# EasyEDA Pro project STM32.epro

# Schematic Schematic1
Board Name: Board1; Create Date: 2025-08-23; Page Name: P1; Project Name: STM32; Schematic Name: Schematic1; Update Date: 2025-08-27; Company: 嘉立创EDA; Page Size: A4; Version: V1.0
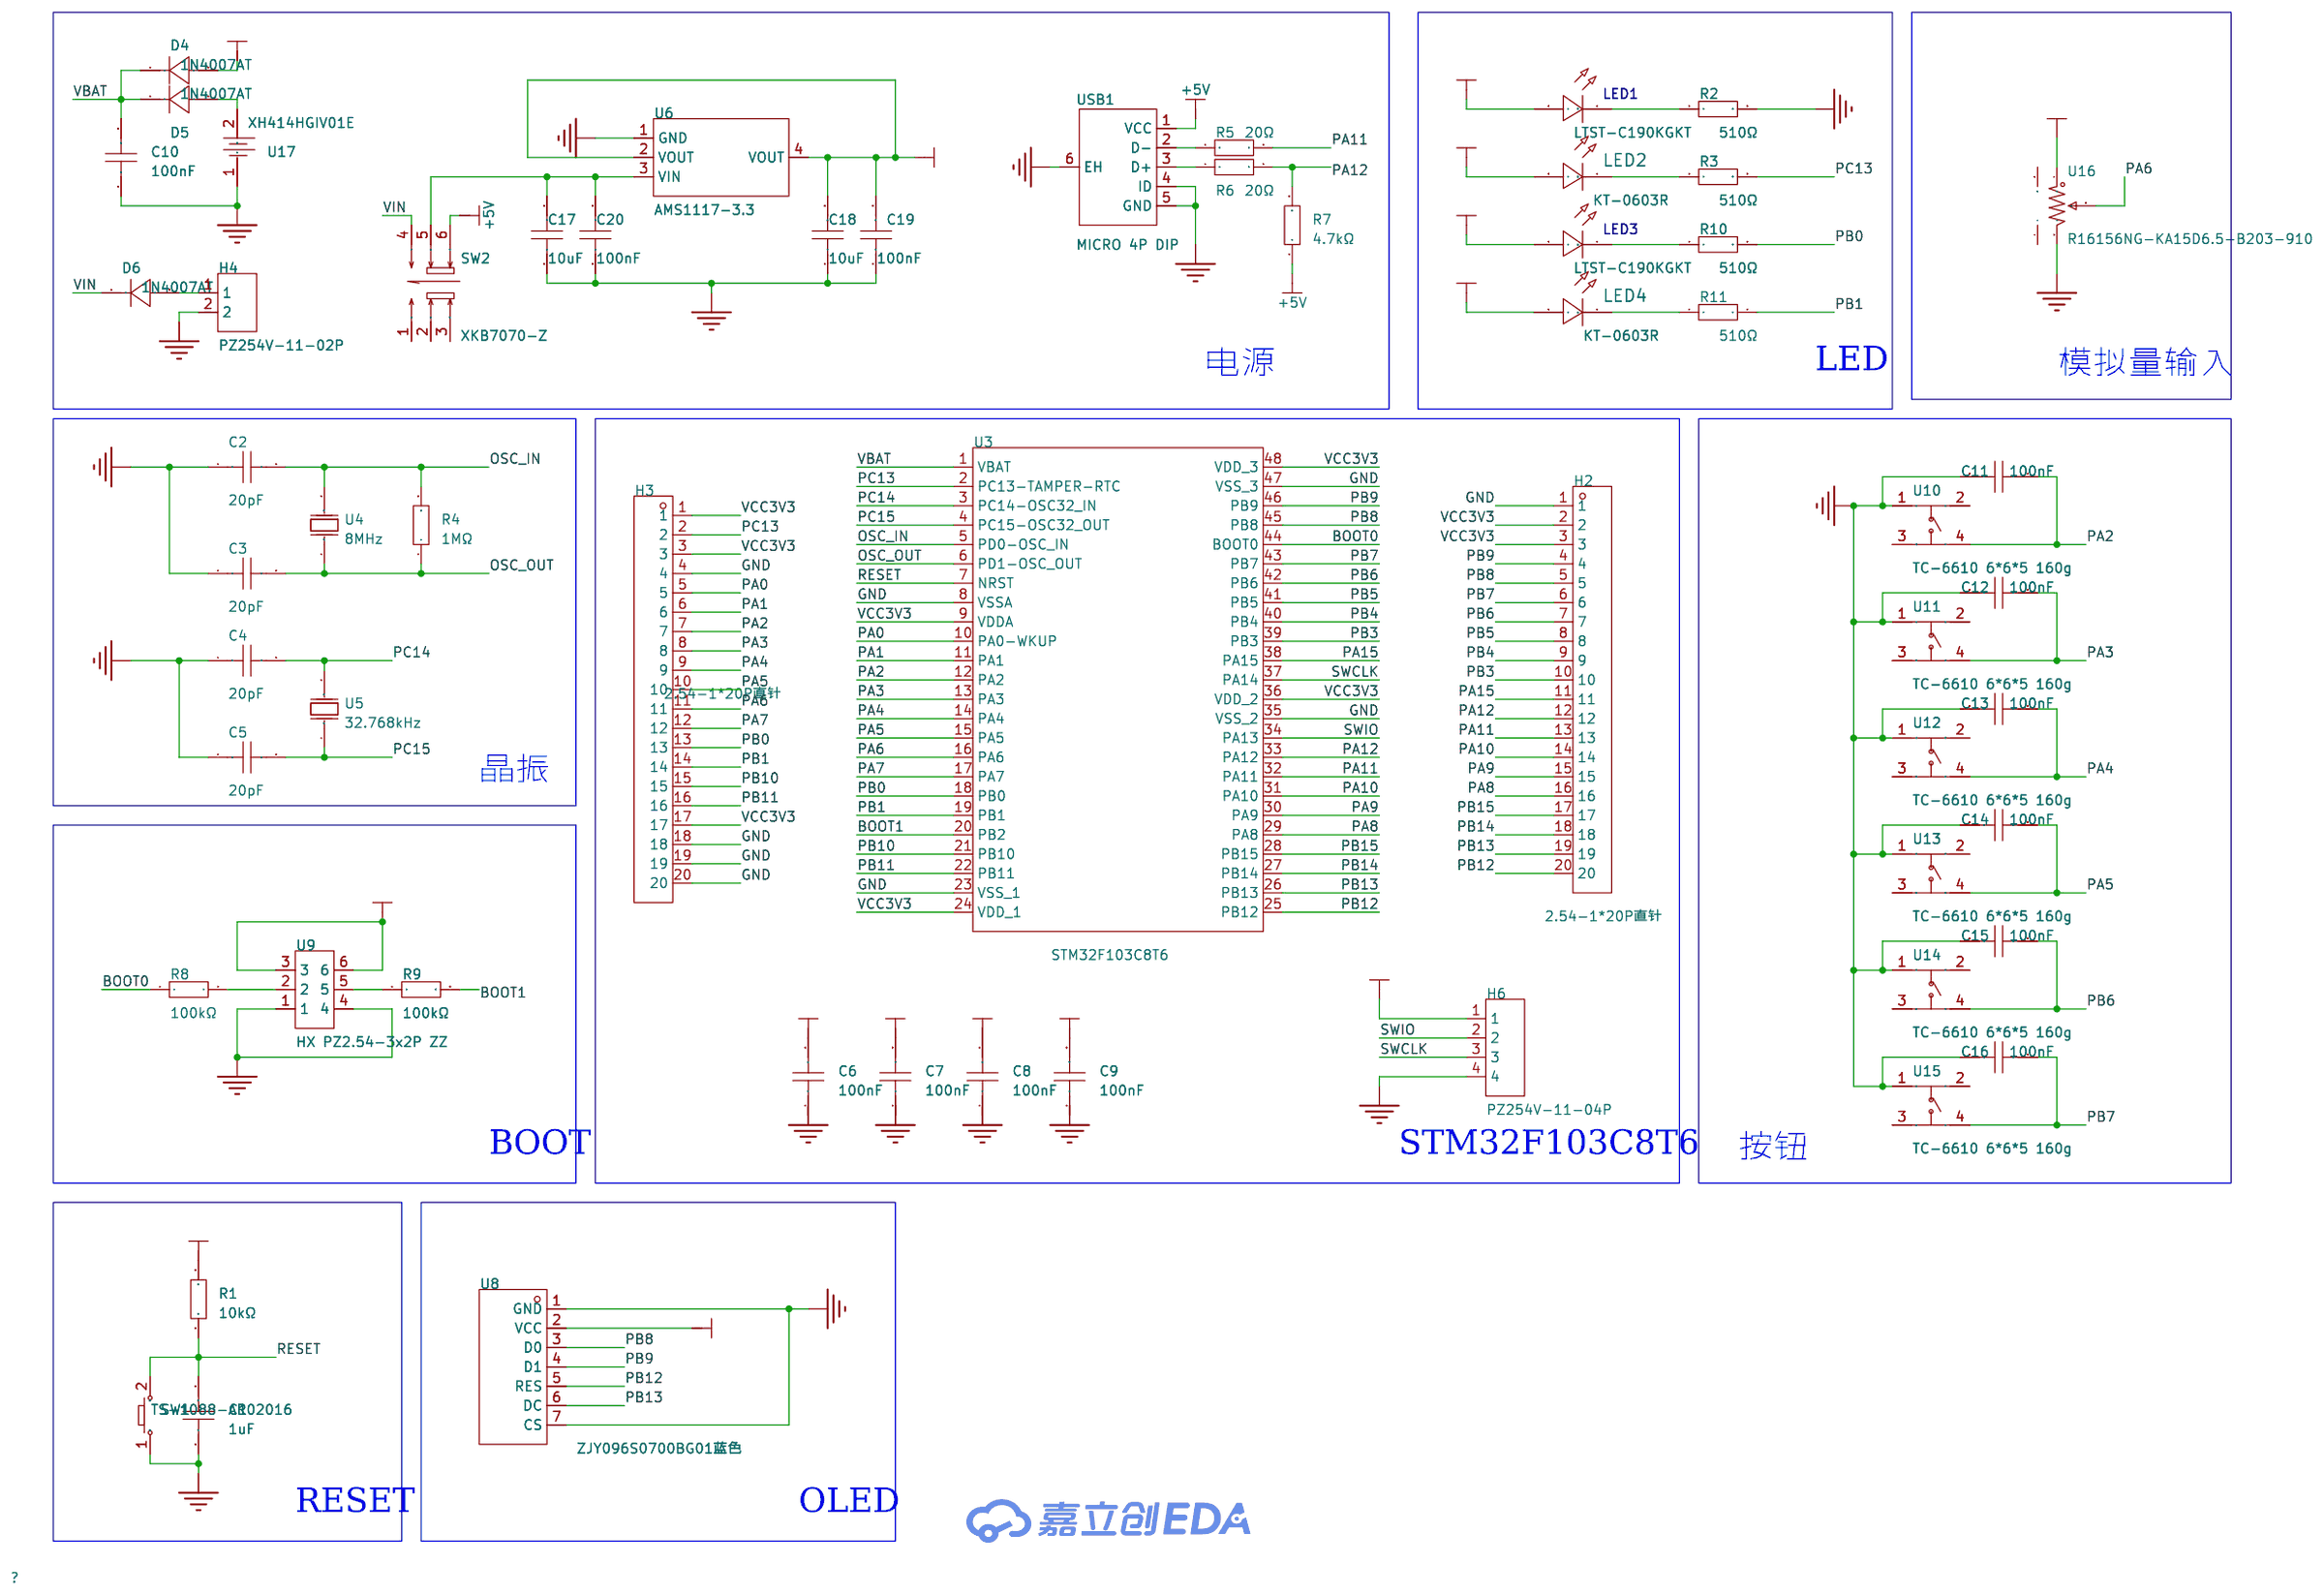
[diagram p0: schematic sheet]

## Parts
C1  1uF  [C0603]
C2  20pF  [C0603]
C3  20pF  [C0603]
C4  20pF  [C0603]
C5  20pF  [C0603]
C6  100nF  [C0603]
C7  100nF  [C0603]
C8  100nF  [C0603]
C9  100nF  [C0603]
C10  100nF  [C0603]
C11  100nF  [C0603]
C12  100nF  [C0603]
C13  100nF  [C0603]
C14  100nF  [C0603]
C15  100nF  [C0603]
C16  100nF  [C0603]
C17  10uF  [C0603]
C18  10uF  [C0603]
C19  100nF  [C0603]
C20  100nF  [C0603]
D4  1N4007AT  [DO_1N4007]
D5  1N4007AT  [DO_1N4007]
D6  1N4007AT  [DO_1N4007]
H2  2.54-1*20P直针  [HDR-TH_20P-P2.54-V-M-1]
H3  2.54-1*20P直针  [HDR-TH_20P-P2.54-V-M-1]
H4  PZ254V-11-02P  [HDR-TH_2P-P2.54-V-M]
H6  PZ254V-11-04P  [HDR-TH_4P-P2.54-V-M]
LED1  LTST-C190KGKT  [LED0603-RD]
LED2  KT-0603R  [LED0603-RD]
LED3  LTST-C190KGKT  [LED0603-RD]
LED4  KT-0603R  [LED0603-RD]
R1  10kΩ  [R0603]
R2  510Ω  [R0603]
R3  510Ω  [R0603]
R4  1MΩ  [R0603]
R5  20Ω  [R0603]
R6  20Ω  [R0603]
R7  4.7kΩ  [R0603]
R8  100kΩ  [R0603]
R9  100kΩ  [R0603]
R10  510Ω  [R0603]
R11  510Ω  [R0603]
SW1  TS-1088-AR02016  [Key_SMD_3x4x2]
SW2  XKB7070-Z  [SW-TH_6P-L7.0-W7.0-P2.00]
U3  STM32F103C8T6  [LQFP-48_L7.0-W7.0-P0.50-LS9.0-BL]
U4  8MHz  [HC-49S_L11.5-W5.0-P4.88]
U5  32.768kHz  [CRYSTAL-SMD_L3.2-W1.5]
U6  AMS1117-3.3  [SOT-223-3_L6.5-W3.4-P2.30-LS7.0-BR]
U8  ZJY096S0700BG01蓝色  [OLED-TH_OLED0.96-SPI]
U9  HX PZ2.54-3x2P ZZ  [HDR-TH_6P-P2.54-V-M-R3-C2-S2.54_2]
U10  TC-6610 6*6*5 160g  [SW-TH_4P-L6.0-W6.0-P4.50-LS6.5]
U11  TC-6610 6*6*5 160g  [SW-TH_4P-L6.0-W6.0-P4.50-LS6.5]
U12  TC-6610 6*6*5 160g  [SW-TH_4P-L6.0-W6.0-P4.50-LS6.5]
U13  TC-6610 6*6*5 160g  [SW-TH_4P-L6.0-W6.0-P4.50-LS6.5]
U14  TC-6610 6*6*5 160g  [SW-TH_4P-L6.0-W6.0-P4.50-LS6.5]
U15  TC-6610 6*6*5 160g  [SW-TH_4P-L6.0-W6.0-P4.50-LS6.5]
U16  R16156NG-KA15D6.5-B203-910  [RES-ADJ-TH_R16156NG-KA15D6.5-B203-910]
U17  XH414HGIV01E  [CAP-SMD_2P-L4.8-W4.8-TR]
USB1  MICRO 4P DIP  [USB_Micro]

## Library data of the parts
C1 = CL10A105KO8NNNC: 容值:1uF;精度:±10%;额定电压:16V;温度系数:X5R;; LCSC Part Name: 1uF ±10% 16V; Supplier Part: C1592; Manufacturer: SAMSUNG(三星); Supplier Footprint: 0603; JLCPCB Part Class: Extended Part; Datasheet: https://item.szlcsc.com/datasheet/CL10A105KO8NNNC/1944.html; Supplier: LCSC; Tolerance: ±10%; Voltage Rating: 16V; Temperature Coefficient: X5R
C2-C5 = CC0603JRNPO9BN200: 容值:20pF;精度:±5%;额定电压:50V;材质(温度系数):NP0;; LCSC Part Name: 20pF ±5% 50V; Supplier Part: C105621; Manufacturer: YAGEO(国巨); Supplier Footprint: 0603; JLCPCB Part Class: Extended Part; Datasheet: https://atta.szlcsc.com/upload/public/pdf/source/20170505/1493957838062.pdf; Supplier: LCSC; Tolerance: ±5%; Voltage Rated: 50V; Temperature Coefficient: NP0
C6-C10 = CGA0603X7R104K500JT: 容值:100nF;精度:±10%;额定电压:50V;温度系数:X7R;; LCSC Part Name: 100nF ±10% 50V; Supplier Part: C6119867; Manufacturer: HRE(芯声); Supplier Footprint: 0603; JLCPCB Part Class: Extended Part; Datasheet: https://atta.szlcsc.com/upload/public/pdf/source/20250103/C44077DA9E7B3EFAE02F22B6D3D1CBC9.pdf; Supplier: LCSC; Tolerance: ±10%; Voltage Rating: 50V; Temperature Coefficient: X7R
C11-C16 C19 C20 = CL10B104KA8NNNC: 容值:100nF;精度:±10%;额定电压:25V;温度系数:X7R;; LCSC Part Name: 100nF ±10% 25V; Supplier Part: C1590; Manufacturer: SAMSUNG(三星); Supplier Footprint: 0603; JLCPCB Part Class: Extended Part; Datasheet: https://item.szlcsc.com/datasheet/CL10B104KA8NNNC/1942.html; Supplier: LCSC; Tolerance: ±10%; Voltage Rating: 25V; Temperature Coefficient: X7R
C17 C18 = CL10A106KP8NNNC: 容值:10uF;精度:±10%;额定电压:10V;温度系数:X5R;; LCSC Part Name: 10uF ±10% 10V; Supplier Part: C19702; Manufacturer: SAMSUNG(三星); Supplier Footprint: 0603; JLCPCB Part Class: Basic Part; Datasheet: https://item.szlcsc.com/datasheet/CL10A106KP8NNNC/20411.html; Supplier: LCSC; Tolerance: ±10%; Voltage Rating: 10V; Temperature Coefficient: X5R
D4-D6 = 1N4007AT: 二极管配置:-;正向压降(Vf):1.1V@1A;直流反向耐压(Vr):1kV;整流电流:1A;; Supplier Part: C2921011; Manufacturer: Agertech(艾吉芯); Supplier Footprint: DO-41; JLCPCB Part Class: Extended Part; Datasheet: https://item.szlcsc.com/datasheet/1N4007AT/3228639.html; Supplier: LCSC; Voltage - Forward(Vf@If): 1.1V@1A; Voltage - DC Reverse(Vr): 1kV; Current - Rectified: 1A; Reverse Leakage Current (Ir): 5uA@1kV; Non-Repetitive Peak Forward Surge Current: 30A; Operating Junction Temperature Range: -65℃~+175℃
H2 H3 = 2.54-1*20P直针: 插针结构:1x20P;间距:2.54mm;行距:-;圆针/方针:方针;安装方式:直插;排数:单排;总PIN位数:20P;额定电流:3A;额定电压:-;配合针长度:-;塑高:-;端接针长度:-;触头材质:黄铜;触头镀层:-;工作温度:-40℃~+105℃;颜色:黑色;; LCSC Part Name: 1x20P 间距:2.54mm 方针 直插; Supplier Part: C50981; Manufacturer: BOOMELE(博穆精密); Supplier Footprint: 插件,P=2.54mm; JLCPCB Part Class: Extended Part; Datasheet: https://item.szlcsc.com/datasheet/2.54-1*20P%25E7%259B%25B4%25E9%2592%2588/51993.html; Supplier: LCSC; Pin Structure: 1x20P; Pitch: 2.54mm; Circluar Pins/Square Pins: 方针; Mounting Type: 直插; Number of Rows: 单排; Number of Pins: 20P; Current Rating: 3A; Contact Material: 黄铜; Operating Temperature: -40℃~+105℃; Color: 黑色
H4 = PZ254V-11-02P: 插针结构:1x2P;间距:2.54mm;行距:-;圆针/方针:方针;安装方式:直插;排数:单排;总PIN位数:2P;额定电流:-;额定电压:-;配合针长度:6mm;塑高:2.5mm;端接针长度:3mm;触头材质:黄铜;触头镀层:-;工作温度:-40℃~+105℃;颜色:黑色;; LCSC Part Name: 1x2P 间距:2.54mm 方针 直插; Supplier Part: C492401; Manufacturer: XFCN(兴飞); Supplier Footprint: 插件,P=2.54mm; JLCPCB Part Class: 扩展库; Datasheet: https://item.szlcsc.com/datasheet/PZ254V-11-02P/502957.html; Supplier: LCSC; Pin Structure: 1x2P; Pitch: 2.54mm; Circluar Pins/Square Pins: 方针; Mounting Type: 直插; Number of Rows: 单排; Number of Pins: 2P; Length of Mating Pin: 6mm; Insulation Height: 2.5mm; Length of End Connection Pin: 3mm; Contact Material: 黄铜; Operating Temperature: -40℃~+105℃; Color: 黑色
H6 = PZ254V-11-04P_C492403: 插针结构:1x4P;间距:2.54mm;行距:-;圆针/方针:方针;安装方式:直插;排数:单排;总PIN位数:4P;额定电流:-;额定电压:-;配合针长度:6mm;塑高:2.5mm;端接针长度:3mm;触头材质:黄铜;触头镀层:-;工作温度:-40℃~+105℃;颜色:黑色;; LCSC Part Name: 1x4P 间距:2.54mm 方针 直插; Supplier Part: C492403; Manufacturer: XFCN(兴飞); Supplier Footprint: 插件,P=2.54mm; JLCPCB Part Class: Extended Part; Datasheet: https://atta.szlcsc.com/upload/public/pdf/source/20200309/C492403_F9F19131791D08044AD4F84F8E751A34.pdf; Supplier: LCSC; Pin Structure: 1x4P; Pitch: 2.54mm; Circluar Pins/Square Pins: 方针; Mounting Type: 直插; Number of Rows: 单排; Number of Pins: 4P; Length of Mating Pin: 6mm; Insulation Height: 2.5mm; Length of End Connection Pin: 3mm; Contact Material: 黄铜; Operating Temperature: -40℃~+105℃; Color: 黑色
LED1 LED3 = LTST-C190KGKT: 发光颜色:黄绿色;正向电压(VF):2V;功率:75mW;正向电流:20mA;主波长:567.5nm~576.5nm;二极管配置:-;透镜颜色:无色透明透镜;色温:-;发光强度:35mcd;发光角度:130°;载带方式:-;工作温度:-30℃~+85℃;; LCSC Part Name: 普绿/黄绿; Supplier Part: C125094; Manufacturer: LITEON(光宝); Supplier Footprint: 0603; JLCPCB Part Class: Extended Part; Datasheet: https://atta.szlcsc.com/upload/public/pdf/source/20180129/C125094_15171883203831315957.pdf; Supplier: LCSC; Emitted Color: 黄绿色; Forward Voltage (VF): 2V; Power Dissipation: 75mW; Forward Current: 20mA; Dominant Wavelength: 567.5nm~576.5nm; Peak Wavelength: 574nm; Lens Color: 无色透明透镜; Luminous Intensity: 35mcd; Viewing Angle: 130°; Operating Temperature: -30℃~+85℃
LED2 LED4 = KT-0603R: 发光颜色:红色;功率:-;正向电流:-;主波长:-;二极管配置:-;透镜颜色:-;色温:-;发光角度:-;载带方式:-;工作温度:-40℃~+85℃;; LCSC Part Name: 0603 红灯 高亮; Supplier Part: C2286; Manufacturer: KENTO; Supplier Footprint: 0603; JLCPCB Part Class: Basic Part; Datasheet: https://atta.szlcsc.com/upload/public/pdf/source/20160616/1466072038404.pdf; Supplier: LCSC; Emitted Color: 红色; Operating Temperature: -40℃~+85℃
R1 = 0603WAF1002T5E: 电阻类型:厚膜电阻;阻值:10kΩ;精度:±1%;功率:100mW;工作电压:75V;温度系数:±100ppm/℃;; LCSC Part Name: 厚膜电阻 10kΩ ±1% 100mW; Supplier Part: C25804; Manufacturer: UNI-ROYAL(厚声); Supplier Footprint: 0603; JLCPCB Part Class: Basic Part; Datasheet: https://item.szlcsc.com/datasheet/0603WAF1002T5E/26547.html; Supplier: LCSC; Type: 厚膜电阻; Tolerance: ±1%; Power(Watts): 100mW; Voltage-Supply(Max): 75V; Temperature Coefficient: ±100ppm/℃; Operating Temperature: -55℃~+155℃
R2 R3 R10 R11 = 0603WAF5100T5E: 电阻类型:厚膜电阻;阻值:510Ω;精度:±1%;功率:100mW;工作电压:75V;温度系数:±100ppm/℃;; LCSC Part Name: 510Ω ±1% 100mW 厚膜电阻; Supplier Part: C23193; Manufacturer: UNI-ROYAL(厚声); Supplier Footprint: 0603; JLCPCB Part Class: Basic Part; Datasheet: https://item.szlcsc.com/datasheet/0603WAF5100T5E/23920.html; Supplier: LCSC; Type: 厚膜电阻; Tolerance: ±1%; Power(Watts): 100mW; Voltage-Supply(Max): 75V; Temperature Coefficient: ±100ppm/℃; Operating Temperature: -55℃~+155℃
R4 = 0603WAF1004T5E: 电阻类型:厚膜电阻;阻值:1MΩ;精度:±1%;功率:100mW;最大工作电压:75V;温度系数:±100ppm/℃;; LCSC Part Name: 1MΩ ±1% 100mW 厚膜电阻; Supplier Part: C22935; Manufacturer: UNI-ROYAL(厚声); Supplier Footprint: 0603; JLCPCB Part Class: Basic Part; Datasheet: https://atta.szlcsc.com/upload/public/pdf/source/20200306/C422600_1E6D84923E4A46A82E41ADD87F860B5C.pdf; Supplier: LCSC; Type: 厚膜电阻; Tolerance: ±1%; Power(Watts): 100mW; Overload Voltage (Max): 75V; Temperature Coefficient: ±100ppm/℃; Operating Temperature Range: -55℃~+155℃
R5 R6 = 0603WAF200JT5E: 电阻类型:厚膜电阻;阻值:20Ω;精度:±1%;功率:100mW;最大工作电压:75V;温度系数:±100ppm/℃;; LCSC Part Name: 20Ω ±1% 100mW 厚膜电阻; Supplier Part: C22950; Manufacturer: UNI-ROYAL(厚声); Supplier Footprint: 0603; JLCPCB Part Class: Basic Part; Datasheet: https://atta.szlcsc.com/upload/public/pdf/source/20200306/C422600_1E6D84923E4A46A82E41ADD87F860B5C.pdf; Supplier: LCSC; Type: 厚膜电阻; Tolerance: ±1%; Power(Watts): 100mW; Overload Voltage (Max): 75V; Temperature Coefficient: ±100ppm/℃; Operating Temperature Range: -55℃~+155℃
R7 = 0603WAF4701T5E: 电阻类型:厚膜电阻;阻值:4.7kΩ;精度:±1%;功率:100mW;工作电压:75V;温度系数:±100ppm/℃;; LCSC Part Name: 4.7kΩ ±1% 100mW 厚膜电阻; Supplier Part: C23162; Manufacturer: UNI-ROYAL(厚声); Supplier Footprint: 0603; JLCPCB Part Class: Basic Part; Datasheet: https://item.szlcsc.com/datasheet/0603WAF4701T5E/23889.html; Supplier: LCSC; Type: 厚膜电阻; Tolerance: ±1%; Power(Watts): 100mW; Voltage-Supply(Max): 75V; Temperature Coefficient: ±100ppm/℃; Operating Temperature: -55℃~+155℃
R8 R9 = 0603WAF1003T5E: 电阻类型:厚膜电阻;阻值:100kΩ;精度:±1%;功率:100mW;工作电压:75V;温度系数:±100ppm/℃;; LCSC Part Name: 100kΩ ±1% 100mW 厚膜电阻; Supplier Part: C25803; Manufacturer: UNI-ROYAL(厚声); Supplier Footprint: 0603; JLCPCB Part Class: Basic Part; Datasheet: https://item.szlcsc.com/datasheet/0603WAF1003T5E/26546.html; Supplier: LCSC; Type: 厚膜电阻; Tolerance: ±1%; Power(Watts): 100mW; Voltage-Supply(Max): 75V; Temperature Coefficient: ±100ppm/℃; Operating Temperature: -55℃~+155℃
SW1 = TS-1088-AR02016: 电路结构:单刀单掷;按钮形状:圆形按钮;作用力:160gf;安装方式:立贴;开关长度:4mm;开关宽度:3mm;开关高度:2mm;带支架:不带;触点电流:50mA;额定电压(DC):12V;绝缘电阻:100MΩ;机械寿命:10万次;; LCSC Part Name: 4*3*2mm 立贴 轻触开关; Supplier Part: C720477; Manufacturer: XUNPU(讯普); Supplier Footprint: SMD; JLCPCB Part Class: Basic Part; Datasheet: https://atta.szlcsc.com/upload/public/pdf/source/20200810/C720475_60D09DD6C54279ADDB2DC25100F1CC11.pdf; Supplier: LCSC; Circuit: 单刀单掷; Actuator Style: 圆形按钮; Operating Force: 160gf; Mounting Style: 立贴; Switch Length: 4mm; Switch Width: 3mm; Switch Height: 2mm; Strike Gundam: 不带; Contact Current: 50mA; Voltage Rating (DC): 12V; Insulation Resistance: 100MΩ; Actuator/Cap Color: 黑色; Pin Style: SMD接片; Mechanical Life: 10万次; Operating Temperature: -30℃~+80℃
SW2 = XKB7070-Z: 自锁/无锁:自锁;安装方式:直插;触点电流:100mA;额定电压 (AC):250V;额定电压 (DC):30V;带灯:不带;作用力:160gf;机械寿命:10万次;; LCSC Part Name: 按键开关   7*7插件自锁 蓝白黑; Supplier Part: C318863; Manufacturer: XKB Connectivity(中国星坤); Supplier Footprint: 插件; JLCPCB Part Class: 扩展库; Datasheet: https://atta.szlcsc.com/upload/public/pdf/source/20211015/75A682A27A424BDE8D93C2CFA14C38FE.pdf; Supplier: LCSC; Self Lock / No Lock: 自锁; Actuator Style: 矩形按钮; Mounting Style: 直插; Contact Current: 100mA; Voltage Rating (AC): 250V; Voltage Rating (DC): 30V; Insulation Resistance: 100MΩ; Actuator/Cap Color: 蓝色; With Lamp: 不带; Pin Style: PC引脚; Operating Force: 160gf; Operating Temperature: -15℃~+55℃; Mechanical Life: 10万次
U3 = STM32F103C8T6: CPU内核:ARM-M3;CPU最大主频:72MHz;应用领域:-;; LCSC Part Name: 主流增强型ARM Cortex-M3 MCU，具有64 KB Flash、72 MHz CPU、电机控制、USB和CAN; Supplier Part: C8734; Manufacturer: ST(意法半导体); Supplier Footprint: LQFP-48(7x7); JLCPCB Part Class: 扩展库; Datasheet: https://item.szlcsc.com/datasheet/STM32F103C8T6/9243.html; Supplier: LCSC; CPU Core: ARM-M3; CPU Maximum Speed: 72MHz; Program Storage Size: 64KB; Program Memory Type: FLASH; Number of I/O: 37; ADC (Bit): 12bit; Voltage - Supply: 2V~3.6V
U4 = RB080001184: 频率:8MHz;常温频差:±20ppm;外接负载电容:20pF;频率稳定度(全温):±30ppm;; LCSC Part Name: 8MHz ±20ppm 20pF; Supplier Part: C7206209; Manufacturer: TROQ(创捷); Supplier Footprint: HC-49S; Datasheet: https://atta.szlcsc.com/upload/public/pdf/source/20230606/2B7EB517C34FF5D54F15C17EF1994A2D.pdf; Supplier: LCSC; Normal temperature Frequency Tolerance: ±20ppm; External load capacitor: 20pF; Frequency Stability(Full temperature range): ±30ppm; Operating Temperature: -40℃~+85℃
U5 = RNE32768082: 晶振类型:贴片晶振;频率:32.768kHz;常温频差:±10ppm;外接负载电容:12.5pF;; LCSC Part Name: 32.768kHz ±10ppm 12.5pF; Supplier Part: C19173092; Manufacturer: TROQ(创捷); Supplier Footprint: SMD3215-2P; JLCPCB Part Class: 扩展库; Datasheet: https://atta.szlcsc.com/upload/public/pdf/source/20231030/E9B07A2B101565E78C41C08206074D11.pdf; Supplier: LCSC; Crystal Type: 贴片晶振; Normal temperature Frequency Tolerance: ±10ppm; External load capacitor: 12.5pF; Operating Temperature: -40℃~+85℃
U6 = AMS1117-3.3_C6186: 输出类型:固定;工作电压:16V;输出电压:3.3V;输出电流:1A;电源纹波抑制比(PSRR):72dB@(120Hz);输出极性:正极;; LCSC Part Name: 输出3.3V 1A; Supplier Part: C6186; Manufacturer: AMS; Supplier Footprint: SOT-223; JLCPCB Part Class: 基础库; Datasheet: https://item.szlcsc.com/datasheet/AMS1117-3.3/6652.html; Supplier: LCSC; Output Type: 固定; Voltage - Supply: 16V; Output Voltage: 3.3V; Output Current: 1A; Power Supply Rejection Ratio (PSRR): 72dB@(120Hz); Voltage Dropout: 1.1V@(800mA); standby current: 5mA; Features: 过流保护；过热保护; Operating Temperature: -40℃~+125℃; Output Configuration: 正极; Number of Outputs: 1
U8 = ZJY096S0700BG01蓝色: Supplier Part: C9900027058; Supplier Footprint: THrough hole; JLCPCB Part Class: 扩展库; Supplier: LCSC; Check: false
U9 = HX PZ2.54-3x2P ZZ: 插针结构:3x2P;间距:2.54mm;行距:2.54mm;圆针/方针:方针;安装方式:直插;排数:三排;总PIN位数:6P;额定电流:3A;额定电压:-;配合针长度:6mm;塑高:2.5mm;端接针长度:3mm;触头材质:黄铜;触头镀层:金;工作温度:-40℃~+105℃;颜色:黑色;; LCSC Part Name: 3x2P 间距:2.54mm 方针 直插; Supplier Part: C32713289; Manufacturer: hanxia(韩下); Supplier Footprint: 插件,P=2.54mm; JLCPCB Part Class: 扩展库; Datasheet: https://item.szlcsc.com/datasheet/HX%2520PZ2.54-3x2P%2520ZZ/34444569.html; Supplier: LCSC; Pin Structure: 3x2P; Pitch: 2.54mm; Row Spacing: 2.54mm; Circluar Pins/Square Pins: 方针; Mounting Type: 直插; Number of Rows: 三排; Number of Pins: 6P; Current Rating: 3A; Length of Mating Pin: 6mm; Insulation Height: 2.5mm; Length of End Connection Pin: 3mm; Contact Material: 黄铜; Contact Plating: 金; Operating Temperature: -40℃~+105℃; Color: 黑色
U10-U15 = TC-6610 6*6*5 160g: 轻触开关  6*6*5 160g力 4.3基座 复银 耐温 ROHS; Supplier Part: C7528706; Manufacturer: FG(富港); Supplier Footprint: 插件,6x6mm; JLCPCB Part Class: 扩展库; Datasheet: https://atta.szlcsc.com/upload/public/pdf/source/20240119/C4B5B07B03893BE63D1CA58047A0B7F3.pdf; Supplier: LCSC
U16 = R16156NG-KA15D6.5-B203-910: 可调电阻旋转电位器单联，旋转角度：300+/-5°，旋转寿命：10000次，使用温度：-10°~+70°; Supplier Part: C19712520; Manufacturer: CTR(长泰尔电子); Supplier Footprint: SIP-3; JLCPCB Part Class: Extended Part; Datasheet: https://atta.szlcsc.com/upload/public/pdf/source/20231222/E479C4CE3DF3C1EB7BA16745320BA9DD.pdf; Supplier: LCSC; Rated Voltage: 20V
U17 = XH414HGIV01E: LCSC Part Name: Seiko/精工，锂电池，3.3V，XH414HGIV01E ，1个; Supplier Part: C916085; Manufacturer: Seiko(精工); Supplier Footprint: SMD,1.9x6.8mm; JLCPCB Part Class: 扩展库; Datasheet: https://item.szlcsc.com/datasheet/XH414HGIV01E/990251.html; Supplier: LCSC
USB1 = MICRO 4P DIP: 连接器类型:Micro-B;标准:USB 2.0;公母:母;安装方式:卧贴;触点数量:5P;端口数量:1;额定电流 - 电源:1A;工作温度范围:-30℃~+80℃;; LCSC Part Name: Micro-B 母 卧贴; Supplier Part: C456008; Manufacturer: SHOU HAN(首韩); Supplier Footprint: SMD; JLCPCB Part Class: Extended Part; Datasheet: https://atta.szlcsc.com/upload/public/pdf/source/20191113/C456008_715AB785ACAEB21AD2CB341B96491593.pdf; Supplier: LCSC; Connector Type: Micro-B; Standard: USB 2.0; Gender: 母; Mounting Style: 卧贴; Number of Contacts: 5P; Number of Ports: 1; Current Rating - Power (Max): 1A; Operating Temperature Range: -30℃~+80℃; Core Colour: 黑色

## Nets
+5V: R7.1 SW2.6 USB1.1(VCC)
GND: C1.1 C2.1 C3.1 C4.1 C5.1 C6.1 C7.1 C8.1 C9.1 C10.1 C11.2 C12.2 C13.2 C14.2 C15.2 C16.2 C17.1 C18.1 C19.1 C20.1 H2.1 H3.4 H3.18 H3.19 H3.20 H4.2 H6.4 R2.2 SW1.1 U3.8(VSSA) U3.23(VSS_1) U3.35(VSS_2) U3.47(VSS_3) U6.1(GND) U8.1(GND) U8.7(CS) U9.1 U9.4 U10.1 U11.1 U12.1 U13.1 U14.1 U15.1 U16.3 U17.1 USB1.4(ID) USB1.5(GND) USB1.6(EH)
VBAT: C10.2 D4.1(K) D5.1(K) U3.1(VBAT)
VCC3V3: C6.2 C7.2 C8.2 C9.2 C18.2 C19.2 D4.2(A) H2.2 H2.3 H3.1 H3.3 H3.17 H6.1 LED1.2(A) LED2.2(A) LED3.2(A) LED4.2(A) R1.2 U3.9(VDDA) U3.24(VDD_1) U3.36(VDD_2) U3.48(VDD_3) U6.2(VOUT) U6.4(VOUT) U8.2(VCC) U9.3 U9.6 U16.1
VIN: D6.1(K) SW2.4
BOOT0: R8.1 U3.44(BOOT0)
BOOT1: R9.2 U3.20(PB2)
OSC_IN: C2.2 R4.2 U3.5(PD0-OSC_IN) U4.2(OSC2)
OSC_OUT: C3.2 R4.1 U3.6(PD1-OSC_OUT) U4.1(OSC1)
PA0: H3.5 U3.10(PA0-WKUP)
PA1: H3.6 U3.11(PA1)
PA2: C11.1 H3.7 U3.12(PA2) U10.4
PA3: C12.1 H3.8 U3.13(PA3) U11.4
PA4: C13.1 H3.9 U3.14(PA4) U12.4
PA5: C14.1 H3.10 U3.15(PA5) U13.4
PA6: H3.11 U3.16(PA6) U16.2
PA7: H3.12 U3.17(PA7)
PA8: H2.16 U3.29(PA8)
PA9: H2.15 U3.30(PA9)
PA10: H2.14 U3.31(PA10)
PA11: H2.13 R5.2 U3.32(PA11)
PA12: H2.12 R6.2 R7.2 U3.33(PA12)
PA15: H2.11 U3.38(PA15)
PB0: H3.13 R10.2 U3.18(PB0)
PB1: H3.14 R11.2 U3.19(PB1)
PB3: H2.10 U3.39(PB3)
PB4: H2.9 U3.40(PB4)
PB5: H2.8 U3.41(PB5)
PB6: C15.1 H2.7 U3.42(PB6) U14.4
PB7: C16.1 H2.6 U3.43(PB7) U15.4
PB8: H2.5 U3.45(PB8) U8.3(D0)
PB9: H2.4 U3.46(PB9) U8.4(D1)
PB10: H3.15 U3.21(PB10)
PB11: H3.16 U3.22(PB11)
PB12: H2.20 U3.25(PB12) U8.5(RES)
PB13: H2.19 U3.26(PB13) U8.6(DC)
PB14: H2.18 U3.27(PB14)
PB15: H2.17 U3.28(PB15)
PC13: H3.2 R3.2 U3.2(PC13-TAMPER-RTC)
PC14: C4.2 U3.3(PC14-OSC32_IN) U5.2(OSC2)
PC15: C5.2 U3.4(PC15-OSC32_OUT) U5.1(OSC1)
RESET: C1.2 R1.1 SW1.2 U3.7(NRST)
SWCLK: H6.3 U3.37(PA14)
SWIO: H6.2 U3.34(PA13)
$1N1419: LED1.1(C) R2.1
$1N1431: LED2.1(C) R3.1
$1N2672: R5.1 USB1.2(D-)
$1N2678: R6.1 USB1.3(D+)
$1N6999: D6.2(A) H4.1
$1N8019: R8.2 U9.2
$1N8023: R9.1 U9.5
$1N9090: LED3.1(C) R10.1
$1N9092: LED4.1(C) R11.1
$1N15033: D5.2(A) U17.2
$1N15247: C17.2 C20.2 SW2.5 U6.3(VIN)

Not connected (* = marked no-connect by the designer): SW2 1 2 3; U10 2 3; U11 2 3; U12 2 3; U13 2 3; U14 2 3; U15 2 3; U16 4 5

## Notes on the sheet
- 电源
- LED
- 模拟量输入
- 晶振
- BOOT
- STM32F103C8T6
- 按钮
- RESET
- OLED

# Board PCB1
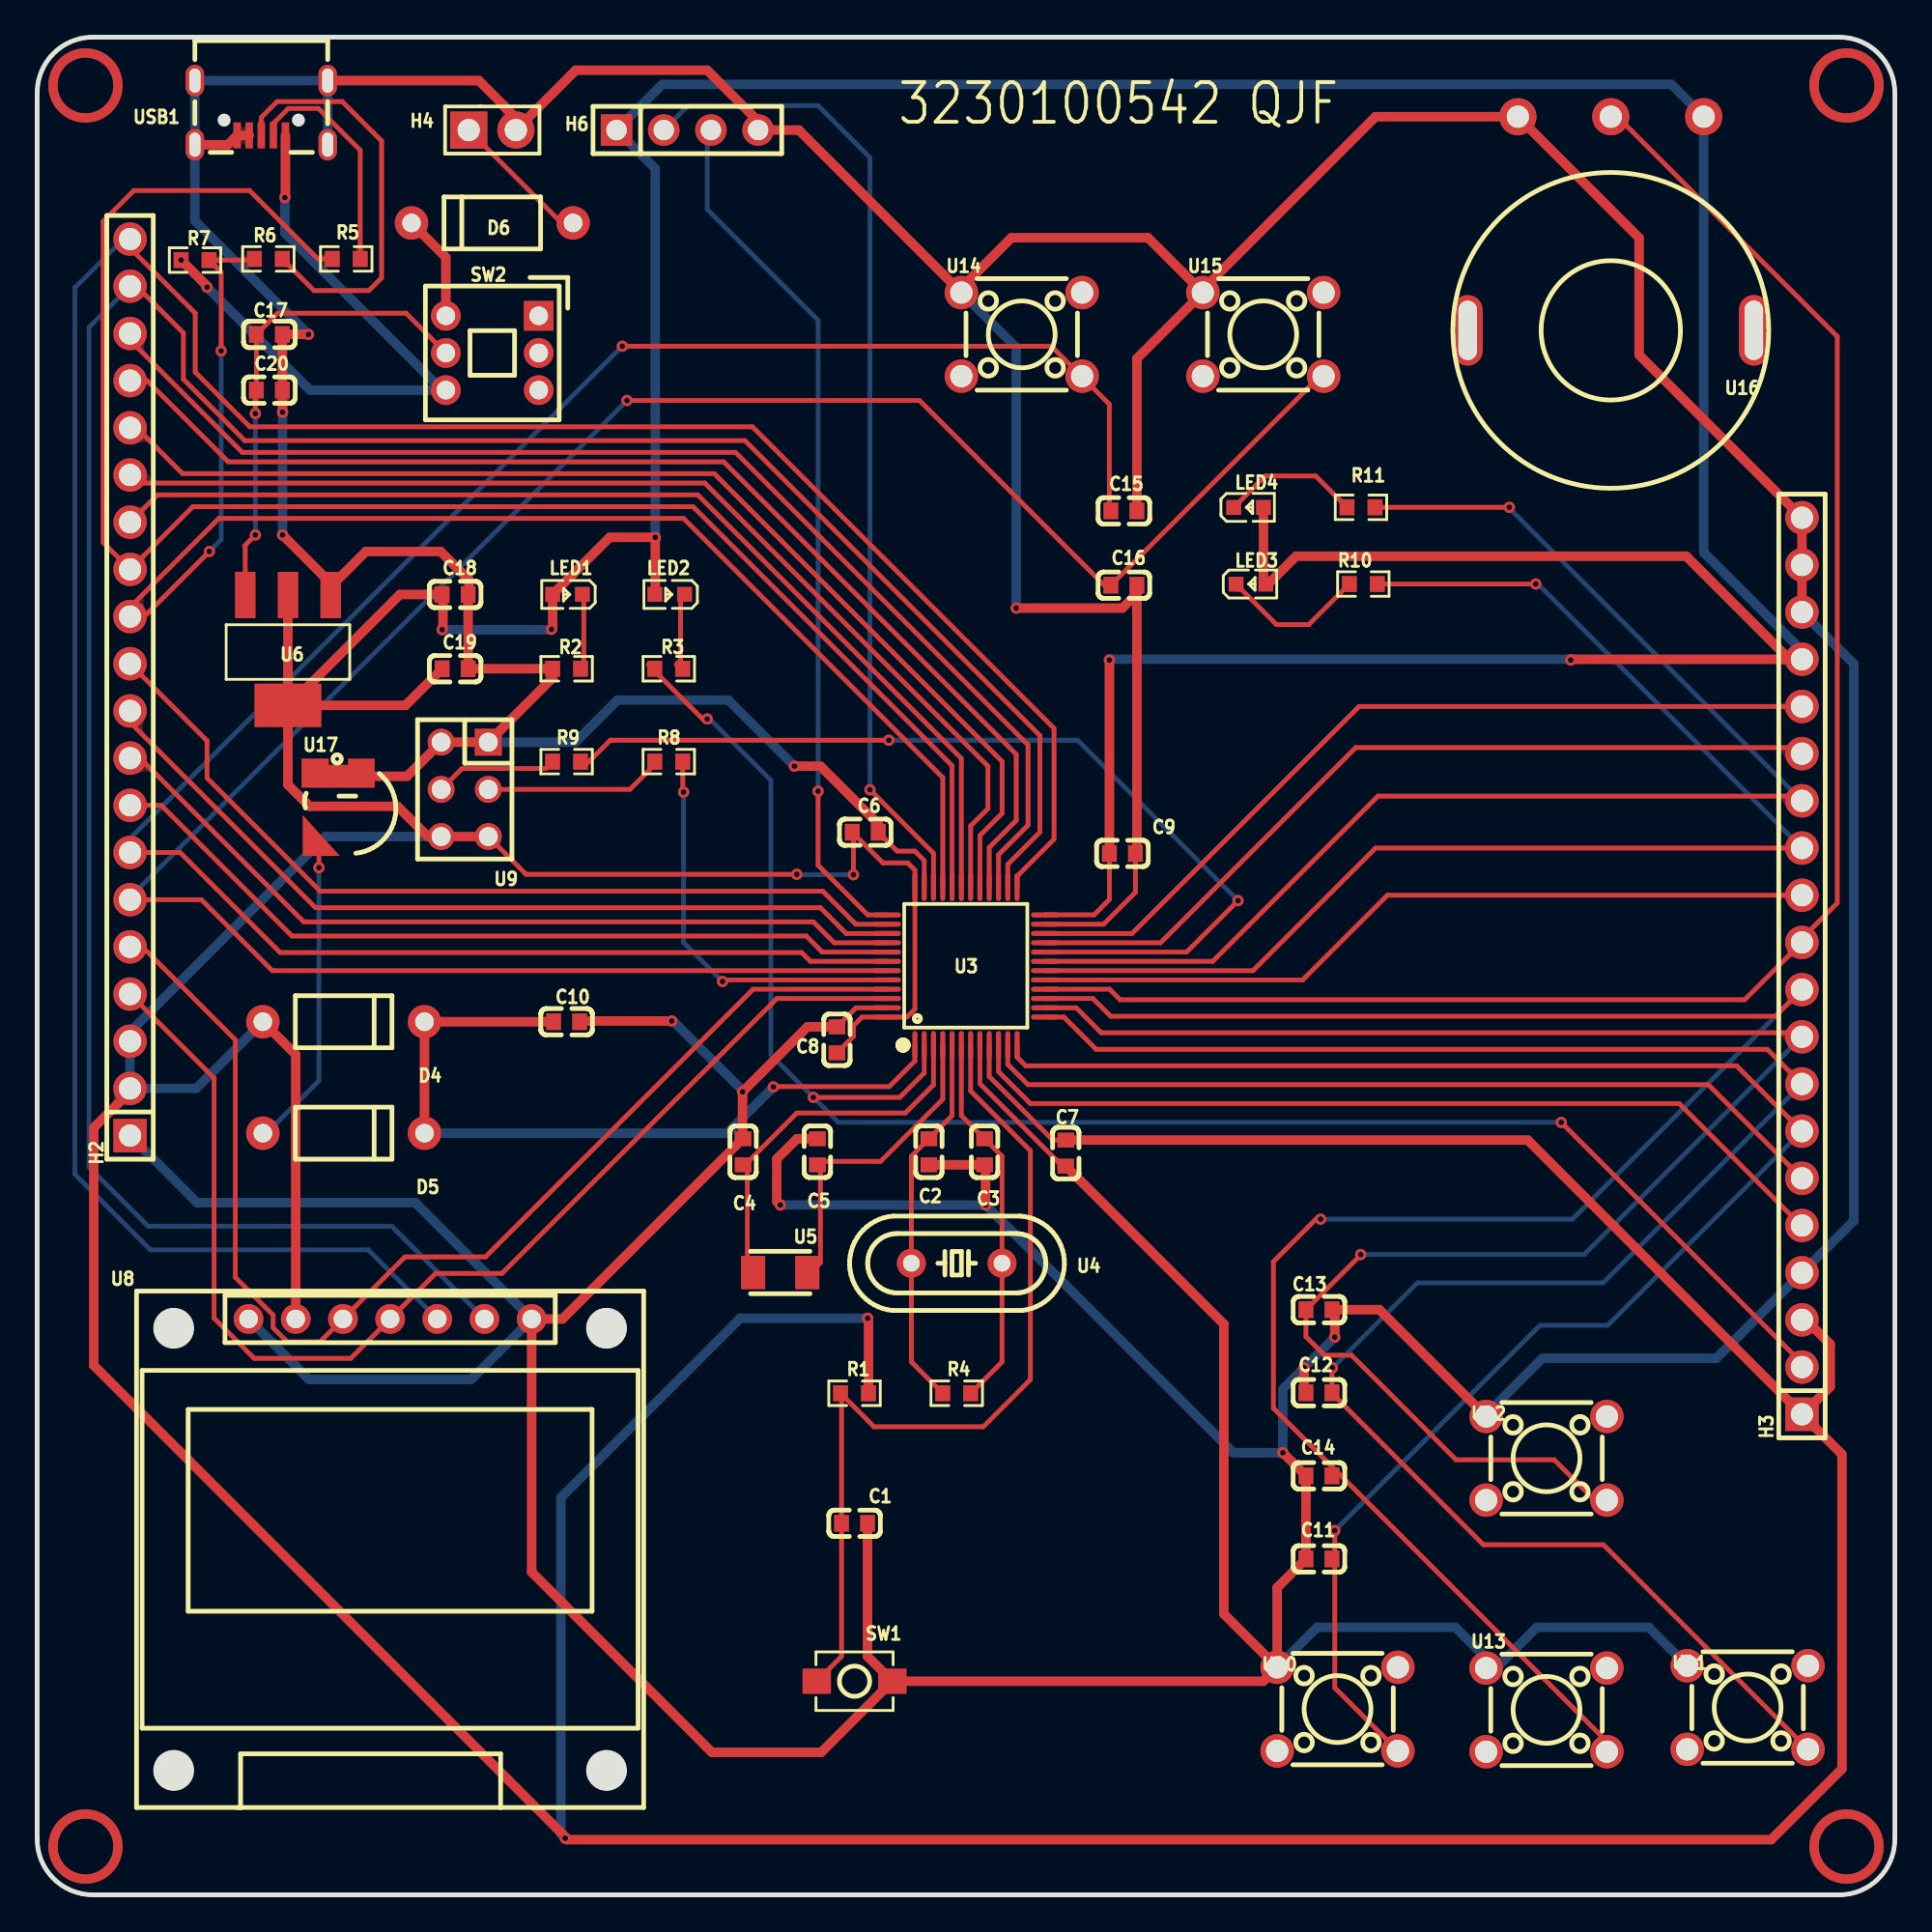
[diagram p1: board, top side]
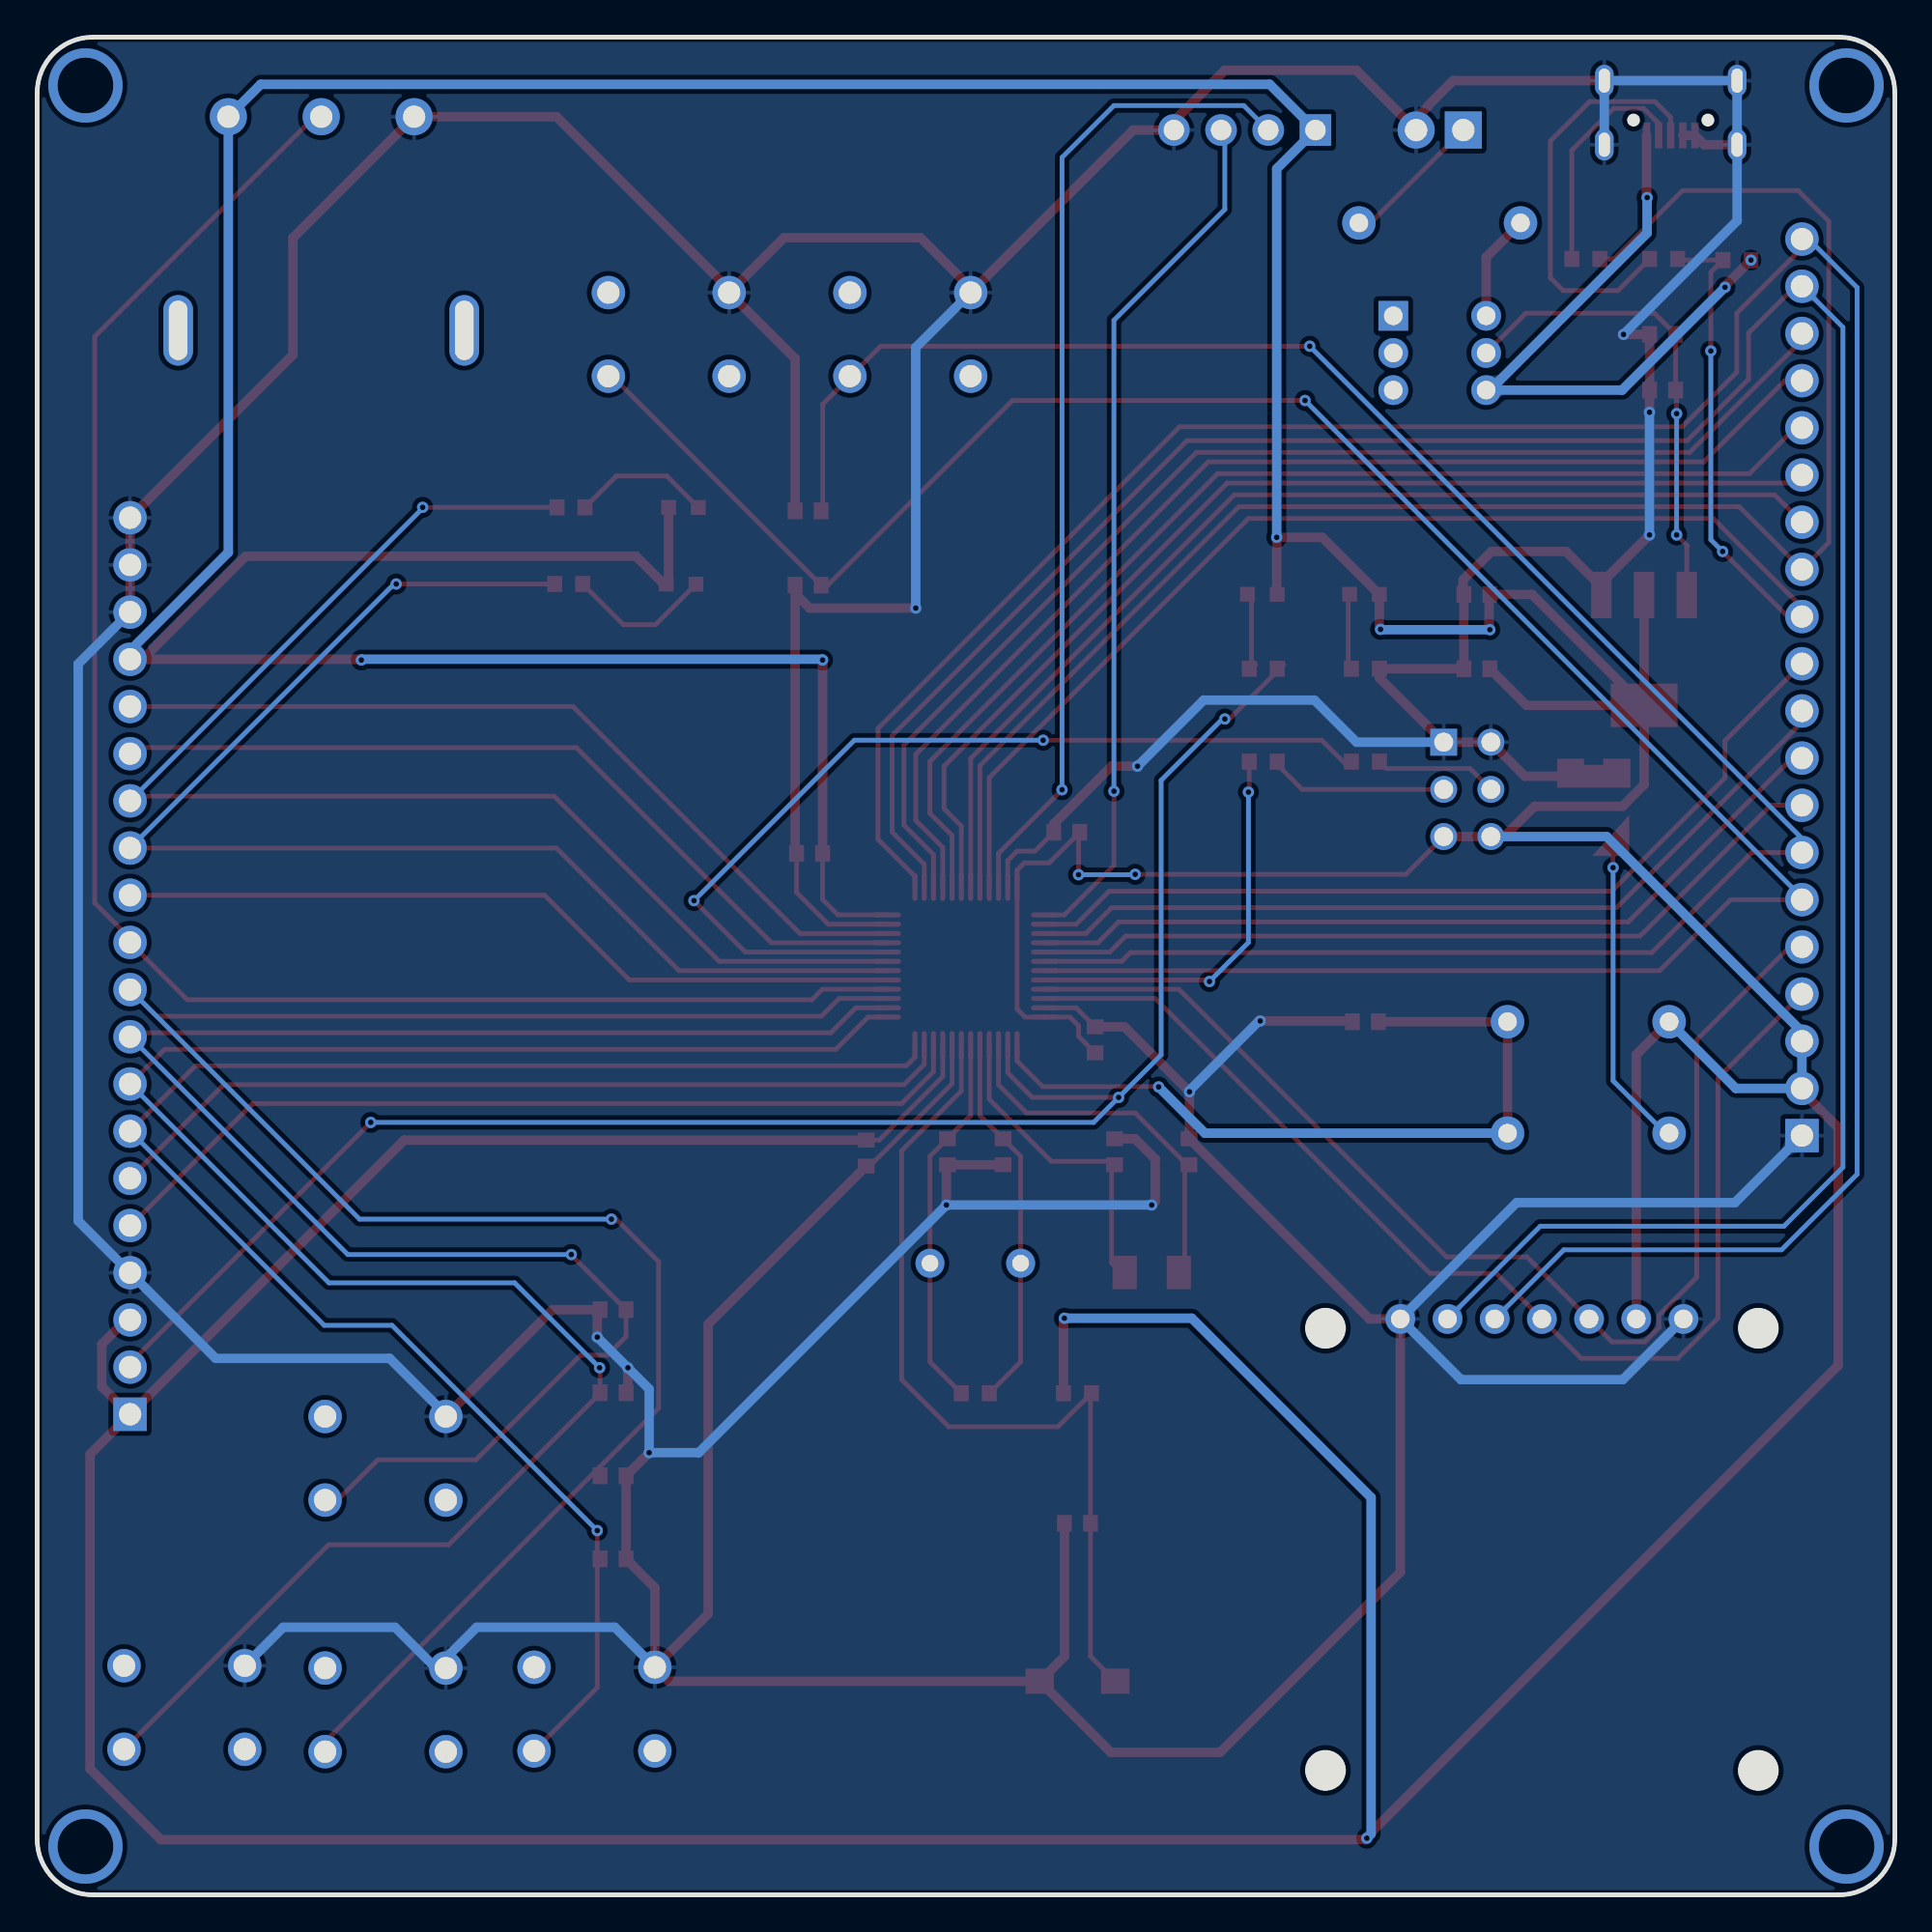
[diagram p2: board, bottom side, seen from below]

Outline 100 x 100 mm; copper layers: Top Layer, Bottom Layer. Coordinates in mm from the lower left corner of the outline.
Outline path: 0,97 0,3 arc(0.88,0.88) 3,0 97,0 arc(99.12,0.88) 100,3 100,97 arc(99.12,99.12) 97,100 3,100 arc(0.88,99.12) 0,97
Stack: Top Layer 0.035mm / Dielectric1 1.51mm FR4 er 4.5 / Bottom Layer 0.035mm

## Design rules (mm)
template: JLCPCB Capability(Two Layers Board)
spacing copperThickness1oz (default): track to track 0.102, other pairs 0.152 to 0.3
spacing copperThickness2oz: track to track 0.203, other pairs 0.152 to 0.3
track width copperThickness1oz (default): min 0.127, default 0.254, max 2.54
track width copperThickness2oz: min 0.203, default 0.254, max 2.54
differential pair differentialPair (default): width min 0.127, default 0.254, max 2.54; gap min 0.152, default 0.152
via viaSize (default): diameter min 0.5, default 0.61, max 10; hole min 0.3, default 0.305, max 6.3

## Placement (name value [footprint] x y rotation side)
C1  1uF  [C0603]  44 20 180 top
C2  20pF  [C0603]  48 40 90 top
C3  20pF  [C0603]  51 40 90 top
C4  20pF  [C0603]  38 40 270 top
C5  20pF  [C0603]  42 40 270 top
C6  100nF  [C0603]  44.58 57.2 180 top
C7  100nF  [C0603]  55.37 39.93 90 top
C8  100nF  [C0603]  43.05 46.03 270 top
C9  100nF  [C0603]  58.42 56.06 180 top
C10  100nF  [C0603]  28.5 47 180 top
C11  100nF  [C0603]  69 18.09 180 top
C12  100nF  [C0603]  69 27.03 180 top
C13  100nF  [C0603]  69 31.5 0 top
C14  100nF  [C0603]  69 22.56 180 top
C15  100nF  [C0603]  58.5 74.5 0 top
C16  100nF  [C0603]  58.5 70.5 0 top
C17  10uF  [C0603]  12.5 84 180 top
C18  10uF  [C0603]  22.5 70 180 top
C19  100nF  [C0603]  22.5 66 180 top
C20  100nF  [C0603]  12.5 81 180 top
D4  1N4007AT  [DO_1N4007]  16.5 47 180 top
D5  1N4007AT  [DO_1N4007]  16.5 41 180 top
D6  1N4007AT  [DO_1N4007]  24.5 90 0 top
H2  2.54-1*20P直针  [HDR-TH_20P-P2.54-V-M-1]  5 65 90 top
H3  2.54-1*20P直针  [HDR-TH_20P-P2.54-V-M-1]  95 50 90 top
H4  PZ254V-11-02P  [HDR-TH_2P-P2.54-V-M]  24.5 95 0 top
H6  PZ254V-11-04P  [HDR-TH_4P-P2.54-V-M]  35 95 0 top
LED1  LTST-C190KGKT  [LED_0603]  28.5 70 180 top
LED2  KT-0603R  [LED_0603]  34 70 180 top
LED3  LTST-C190KGKT  [LED_0603]  65.39 70.56 0 top
LED4  KT-0603R  [LED_0603]  65.26 74.69 0 top
R1  10kΩ  [R0603]  44 27 0 top
R2  510Ω  [R0603]  28.5 66 180 top
R3  510Ω  [R0603]  34 66 180 top
R4  1MΩ  [R0603]  49.5 27 180 top
R5  20Ω  [R0603]  16.64 88.06 180 top
R6  20Ω  [R0603]  12.45 88.06 180 top
R7  4.7kΩ  [R0603]  8.5 88 0 top
R8  100kΩ  [R0603]  34 61 180 top
R9  100kΩ  [R0603]  28.5 61 0 top
R10  510Ω  [R0603]  71.39 70.56 0 top
R11  510Ω  [R0603]  71.26 74.69 0 top
SW1  TS-1088-AR02016  [Key_SMD_3x4x2]  44 11.5 180 top
SW2  XKB7070-Z  [SW-TH_6P-L7.0-W7.0-P2.00]  24.5 83 0 top
U3  STM32F103C8T6  [LQFP-48_L7.0-W7.0-P0.50-LS9.0-BL]  50 50 0 top
U4  8MHz  [HC-49S_L11.5-W5.0-P4.88]  49.5 34 180 top
U5  32.768kHz  [CRYSTAL-SMD_L3.2-W1.5]  40 33.5 180 top
U6  AMS1117-3.3  [SOT-223-3_L6.5-W3.4-P2.30-LS7.0-BR]  13.5 67 90 top
U8  ZJY096S0700BG01蓝色  [OLED-TH_OLED0.96-SPI]  19 31 0 top
U9  HX PZ2.54-3x2P ZZ  [HDR-TH_6P-P2.54-V-M-R3-C2-S2.54_2]  23.02 59.51 180 top
U10  TC-6610 6*6*5 160g  [SW-TH_4P-L6.0-W6.0-P4.50-LS6.5]  70 10 0 top
U11  TC-6610 6*6*5 160g  [SW-TH_4P-L6.0-W6.0-P4.50-LS6.5]  92.07 10.08 0 top
U12  TC-6610 6*6*5 160g  [SW-TH_4P-L6.0-W6.0-P4.50-LS6.5]  81.25 23.5 0 top
U13  TC-6610 6*6*5 160g  [SW-TH_4P-L6.0-W6.0-P4.50-LS6.5]  81.25 9.96 0 top
U14  TC-6610 6*6*5 160g  [SW-TH_4P-L6.0-W6.0-P4.50-LS6.5]  53 84 0 top
U15  TC-6610 6*6*5 160g  [SW-TH_4P-L6.0-W6.0-P4.50-LS6.5]  66 84 0 top
U16  R16156NG-KA15D6.5-B203-910  [RES-ADJ-TH_R16156NG-KA15D6.5-B203-910]  84.71 89.97 180 top
U17  XH414HGIV01E  [CAP-SMD_2P-L4.8-W4.8-TR]  15.75 58.34 0 top
USB1  MICRO 4P DIP  [USB_Micro]  12.06 95.94 180 top

## Footprints (pads in the part's own frame, mm; a bottom-side part is the same pattern mirrored in y, then rotated)
C0603
  rect 0.8x0.9 smd: 1(-0.7,0) 2(0.7,0)
CAP-SMD_2P-L4.8-W4.8-TR
  custom 3.939x1.563 smd: 1(0.454,1.869)
  custom 1.999x2.202 smd: 2(-0.454,-1.869)
CRYSTAL-SMD_L3.2-W1.5
  rect 1.3x1.8 smd: 1(-1.458,0) 2(1.458,0)
DO_1N4007
  round 1.8 hole 1: 1(-4.35,0) 2(4.35,0)
HC-49S_L11.5-W5.0-P4.88
  round 1.56 hole 0.9: 1(-2.44,0) 2(2.44,0)
HDR-TH_2P-P2.54-V-M
  rect 2x2 hole 1.2: 1(-1.27,0)
  round 2 hole 1.2: 2(1.27,0)
HDR-TH_4P-P2.54-V-M
  rect 1.7x1.7 hole 1.1: 1(-3.81,0)
  round 1.7 hole 1.1: 2(-1.27,0) 3(1.27,0) 4(3.81,0)
HDR-TH_6P-P2.54-V-M-R3-C2-S2.54_2
  rect 1.45x1.45 hole 1.02: 1(-1.27,-2.54)
  round 1.45 hole 1.02: 2(-1.27,0) 3(-1.27,2.54) 4(1.27,-2.54) 5(1.27,0) 6(1.27,2.54)
HDR-TH_20P-P2.54-V-M-1
  rect 1.8x1.8 hole 1.2: 1(-24.13,0)
  round 1.8 hole 1.2: 2(-21.59,0) 3(-19.05,0) 4(-16.51,0) 5(-13.97,0) 6(-11.43,0) 7(-8.89,0) 8(-6.35,0) 9(-3.81,0) 10(-1.27,0) 11(1.27,0) 12(3.81,0) 13(6.35,0) 14(8.89,0) 15(11.43,0) 16(13.97,0) 17(16.51,0) 18(19.05,0) 19(21.59,0) 20(24.13,0)
Key_SMD_3x4x2
  rect 1.53x1.36 smd: 1(-2.035,0) 2(2.035,0)
LED_0603
  rect 0.8x0.8 smd: 1(-0.851,-0.01) 2(0.75,-0.005)
LQFP-48_L7.0-W7.0-P0.50-LS9.0-BL
  oval 0.27x1.5 smd: 1(-2.75,-4.25) 2(-2.25,-4.25) 3(-1.75,-4.25) 4(-1.25,-4.25) 5(-0.75,-4.25) 6(-0.25,-4.25) 7(0.25,-4.25) 8(0.75,-4.25) 9(1.25,-4.25) 10(1.75,-4.25) 11(2.25,-4.25) 12(2.75,-4.25) 25(2.75,4.25) 26(2.25,4.25) 27(1.75,4.25) 28(1.25,4.25) 29(0.75,4.25) 30(0.25,4.25) 31(-0.25,4.25) 32(-0.75,4.25) 33(-1.25,4.25) 34(-1.75,4.25) 35(-2.25,4.25) 36(-2.75,4.25)
  oval 1.5x0.27 smd: 13(4.25,-2.75) 14(4.25,-2.25) 15(4.25,-1.75) 16(4.25,-1.25) 17(4.25,-0.75) 18(4.25,-0.25) 19(4.25,0.25) 20(4.25,0.75) 21(4.25,1.25) 22(4.25,1.75) 23(4.25,2.25) 24(4.25,2.75) 37(-4.25,2.75) 38(-4.25,2.25) 39(-4.25,1.75) 40(-4.25,1.25) 41(-4.25,0.75) 42(-4.25,0.25) 43(-4.25,-0.25) 44(-4.25,-0.75) 45(-4.25,-1.25) 46(-4.25,-1.75) 47(-4.25,-2.25) 48(-4.25,-2.75)
OLED-TH_OLED0.96-SPI
  round 1.6 hole 1: 1(-7.62,0) 2(-5.08,0) 3(-2.54,0) 4(0,0) 5(2.54,0) 6(5.08,0) 7(7.62,0)
R0603
  rect 0.806x0.864 smd: 1(-0.753,0) 2(0.753,0)
RES-ADJ-TH_R16156NG-KA15D6.5-B203-910
  round 2 hole 1.2: 1(-5,-5.75) 2(0,-5.75) 3(5,-5.75)
  oval 1.6x3.8 hole 1x3.2: 4(-7.7,5.75) 5(7.7,5.75)
SOT-223-3_L6.5-W3.4-P2.30-LS7.0-BR
  rect 2.5x1.1 smd: 1(2.97,-2.3) 2(2.97,0) 3(2.97,2.3)
  rect 2.34x3.6 smd: 4(-2.97,0)
SW-TH_4P-L6.0-W6.0-P4.50-LS6.5
  round 1.8 hole 1.2: 1(-3.25,2.25) 2(3.25,2.25) 3(-3.25,-2.25) 4(3.25,-2.25)
SW-TH_6P-L7.0-W7.0-P2.00
  rect 1.6x1.6 hole 1: 1(2.499,2)
  round 1.6 hole 1: 2(2.5,0) 3(2.5,-2) 4(-2.5,2) 5(-2.5,0) 6(-2.5,-2)
USB_Micro
  rect 0.4x1.4 smd: 1(-1.3,1.225) 2(-0.65,1.225) 3(0,1.225) 4(0.65,1.225) 5(1.3,1.225)
  oval 1x1.7 hole 0.6x1.3: 6(-3.575,1.725) 6(-3.575,-1.725) 6(3.575,1.725) 6(3.575,-1.725)

## Nets
As in the schematic.

Pads without a net: SW2 1 2 3; U10 2 3; U11 2 3; U12 2 3; U13 2 3; U14 2 3; U15 2 3; U16 4 5

## Via types
v1: diameter 4, hole 3, Top Layer to Bottom Layer, 4 vias
v2: diameter 0.61, hole 0.305, Top Layer to Bottom Layer, 47 vias

## Routing (per net, layer and track width the routed paths; a pad name or vN(x,y) marks a point on that pad's centre or on a via; arc(x,y) is an arc through that point)
+5V: length 34.4
  Top Layer w0.508: v2(13.33,91.36) 13.36,91.39 USB1.1 ; v2(7.75,88) 9.14,86.6 v2(9.14,86.54)
  Bottom Layer w0.508: 21.79,81 13.33,89.46 v2(13.33,91.36) ; 21.79,81 14.68,81 v2(9.14,86.54) ; 21.79,81 SW2.6
GND: length 630.6
  Top Layer w0.254: U3.8 50.75,43.66 55.18,39.23 C7.1 ; C9.1 59.12,53.96 57.41,52.25 U3.23 ; C6.1 46.29,56.19 47.24,56.19 47.75,55.68 U3.35 ; 43.05,46.72 44.08,47.75 U3.47
  Top Layer w0.508: SW1.1 42.21,7.67 36.32,7.67 26.62,17.37 U8.7 28.28,31 37.98,40.7 C4.1 37.97,40.73 v2(37.97,43.23) 41.47,46.72 43.05,46.72 ; SW1.1 44.7,12.84 C1.1 ; SW1.1 66,11.5 U10.1 ; U15.1 59.2,82.7 C15.2 ; U15.1 59.79,89.2 52.45,89.2 49.75,86.5 U14.1 41,95 H6.4 38.81,95.48 36.07,98.22 28.99,98.22 H4.2 25.77,95.64 25.14,96.26 25.14,96.3 23.78,97.66 15.64,97.66 ; U15.1 62.75,86.42 72.04,95.72 U16.3 86.23,89.19 86.23,82.9 H3.20 H3.19 H3.18 ; C18.1 C19.1 R2.2 27.75,65.51 U9.1 U9.4 19.91,60.21 U17.1 ; C5.1 40.9,40.7 39.81,39.61 39.81,37.33 v2(40,37.14) ; C6.1 45.28,57.64 42.16,60.76 v2(40.77,60.76) ; U10.1 66.75,16.53 C11.2 C14.2 v2(67.06,23.8) ; U10.1 63.88,15.12 63.88,30.72 C7.1 ; 23.24,70.41 23.24,70.79 21.72,72.31 17.7,72.31 15.95,70.56 15.85,70.56 v2(13.21,73.2) ; v2(34.16,47.04) 29.24,47.04 C10.1 ; U12.1 72.25,31.5 C13.2 69.85,31.35 v2(69.85,30.02) ; v2(51.05,37.14) 51.05,39.25 C3.1 C2.1 ; v2(68.2,28.37) 68.2,27.13 C12.2 ; 59.2,70.05 59.2,56.14 C9.1 ; 59.2,70.05 C16.2 ; 59.2,70.05 58.42,69.27 v2(52.71,69.27) ; v2(14.61,84) 14.6,84 C17.1 C20.1 13.21,80.99 v2(13.21,79.81) ; USB1.6 10.27,94.21 USB1.5 11.42,94.71
  Bottom Layer w0.508: H3.18 97.79,66.26 97.79,36.28 H3.4 90.39,28.88 81.03,28.88 78,25.85 U12.1 ; v2(40,37.14) v2(51.05,37.14) 64.39,23.8 v2(67.06,23.8) 67.06,27.23 v2(68.2,28.37) v2(69.85,30.02) ; v2(40.77,60.76) 37.21,64.31 31.24,64.31 28.98,62.05 U9.1 ; v2(13.21,79.81) v2(13.21,73.2) ; v2(37.97,43.23) 37.97,43.3 34.23,47.04 v2(34.16,47.04) ; U10.1 68.9,14.4 76.34,14.4 78.54,12.21 80.73,14.4 86.76,14.4 U11.1 ; v2(14.61,84) 8.49,90.11 USB1.6 8.49,97.66 15.64,97.66 USB1.6 ; U8.1 14.64,27.74 23.36,27.74 U8.7 20.36,37.26 8.61,37.26 H2.1 ; U14.1 52.71,83.3 v2(52.71,69.27)
VBAT: length 41.8
  Top Layer w0.254: U3.1 47.25,44.89 45.87,43.51 39.65,43.51 v2(39.63,43.49)
  Top Layer w0.508: C10.2 D4.1 D5.1
  Bottom Layer w0.508: D5.1 37.14,41 v2(39.63,43.49)
VCC3V3: length 599.3
  Top Layer w0.254: U3.9 51.25,44.05 54.67,40.63 C7.2 ; v2(40.89,54.94) 26.32,54.94 U9.3 ; U3.24 54.26,52.76 56.9,52.76 57.72,53.58 C9.2 ; C8.2 43.94,46.21 43.94,46.79 44.41,47.25 U3.48 46.82,47.25 47.25,47.68 U3.36 47.25,55.16 46.86,55.55 45.53,55.55 43.94,57.14 ; C6.2 43.94,57.14 ; 43.94,57.14 v2(43.94,54.92)
  Top Layer w0.508: H3.17 82.59,66.51 v2(82.55,66.47) ; D4.2 13.92,45.23 U8.2 ; v2(27.69,68.12) 27.75,68.19 LED1.2 30.82,73.08 v2(33.27,73.08) 33.27,70.03 LED2.2 ; C19.2 19.83,64.03 13.56,64.03 ; H3.1 95.03,25.87 96.52,27.36 96.52,29.64 95.21,30.95 H3.3 ; H3.1 80.24,40.63 C7.2 ; H3.1 97.16,23.72 97.16,6.78 93.34,2.97 28.5,2.97 v2(28.42,3.05) 28.42,3.12 3.05,28.5 3.05,41.29 5,43.24 H2.2 ; U6.4 13.5,59.76 14.66,58.6 19.4,58.6 21.03,56.97 U9.6 U9.3 ; U6.4 U6.2 ; U6.4 13.56,64.03 ; v2(21.8,68.1) 21.84,68.15 21.84,69.96 C18.2 19.53,70 13.56,64.03 ; C9.2 v2(57.72,66.47) ; v2(44.7,31.04) 44.75,30.99 R1.2 ; LED4.2 66.01,70.69 LED3.2 66.27,70.56 67.77,72.06 88.77,72.06 94.32,66.51
  Bottom Layer w0.254: v2(43.94,54.92) 40.91,54.92 v2(40.89,54.94)
  Bottom Layer w0.508: D4.2 8.56,43.41 H2.2 H2.3 5,46.45 15.52,56.97 U9.6 ; v2(27.69,68.12) 27.67,68.1 v2(21.8,68.1) ; H3.17 95,66.98 89.71,72.27 U16.1 87.97,97.46 33.65,97.46 H6.1 33.27,92.92 v2(33.27,73.08) ; v2(57.72,66.47) 57.76,66.52 82.51,66.52 v2(82.55,66.47) ; v2(44.7,31.04) 37.85,31.04 28.19,21.39 28.19,3.28 v2(28.42,3.05)
VIN: length 5.8
  Top Layer w0.508: SW2.4 22,88.15 D6.1
(no net):
  vias: v1(2.6,97.4) v1(2.6,2.6) v1(97.4,97.4) v1(97.4,2.6)
BOOT0: length 21.6
  Top Layer w0.254: R8.1 34.75,59.4 v2(34.8,59.36) ; U3.44 36.98,49.25 v2(36.89,49.17)
  Bottom Layer w0.254: v2(36.89,49.17) 34.8,51.26 v2(34.8,59.36)
BOOT1: length 50.9
  Top Layer w0.254: U3.20 61.88,50.75 v2(64.64,53.52) ; 29.46,60.76 30.85,62.15 v2(45.85,62.15)
  Bottom Layer w0.254: v2(64.64,53.52) 56.01,62.15 v2(45.85,62.15)
OSC_IN: length 20.4
  Top Layer w0.254: R4.2 47.06,28.69 U4.2 47.06,39.76 C2.2 49.25,41.95 U3.5
OSC_OUT: length 20.4
  Top Layer w0.254: U3.6 49.75,41.95 C3.2 51.94,39.76 U4.1 51.94,28.69 R4.1
PA0: length 48.1
  Top Layer w0.254: H3.5 94.96,36.03 88.39,42.6 53.47,42.6 51.75,44.31 U3.10
PA1: length 46.3
  Top Layer w0.254: H3.6 89.96,43.61 53.34,43.61 52.25,44.7 U3.11
PA2: length 91.9
  Top Layer w0.254: H3.7 91.48,44.63 53.21,44.63 52.75,45.09 U3.12 ; U10.4 69.85,11.15 v2(69.85,19.61)
  Bottom Layer w0.254: H3.7 84.55,30.66 80.9,30.66 v2(69.85,19.61)
PA3: length 108.8
  Top Layer w0.254: U11.4 84.31,18.85 77.85,18.85 69.7,27 69.7,28.35 v2(69.72,28.37) ; H3.8 93.13,45.52 57,45.52 55.27,47.25 U3.13
  Bottom Layer w0.254: H3.8 84.29,32.94 74.29,32.94 v2(69.72,28.37)
PA4: length 95.5
  Top Layer w0.254: U12.4 83.83,21.25 81.66,23.42 76.38,23.42 70.75,29.05 69.3,29.05 68.3,30.05 C13.1 71.25,34.45 v2(71.25,34.47) ; U3.14 55.93,47.75 57.28,46.41 94.78,46.41 H3.9
  Bottom Layer w0.254: H3.9 83.28,34.47 v2(71.25,34.47)
PA5: length 110.3
  Top Layer w0.254: 85.04,7.71 66.55,26.2 66.55,34.09 68.83,36.37 v2(69.09,36.37) ; H3.10 93.56,47.3 57.78,47.3 56.83,48.25 U3.15
  Bottom Layer w0.254: v2(69.09,36.37) 82.64,36.37 H3.10
PA6: length 93.3
  Top Layer w0.254: U3.16 57.73,48.75 58.29,48.18 91.91,48.18 H3.11 95,51.49 96.9,53.39 96.9,83.88 84.71,96.08 U16.2
PA7: length 42.6
  Top Layer w0.254: H3.12 72.68,53.81 68.12,49.25 U3.17
PA8: length 61.6
  Top Layer w0.254: U3.29 50.75,57.02 51.94,58.22 51.94,61.01 36.45,76.5 7.82,76.5 5.36,78.97 H2.16
PA9: length 59.6
  Top Layer w0.254: H2.15 5.43,76 35.94,76 51.18,60.76 51.18,58.47 50.25,57.54 U3.30
PA10: length 58.2
  Top Layer w0.254: U3.31 49.75,61.17 35.56,75.36 6.47,75.36 H2.14
PA11: length 91.8
  Top Layer w0.254: U3.32 49.25,60.78 35.31,74.73 8.38,74.73 5,71.35 H2.13 3.56,72.79 3.56,90.09 5.21,91.75 11.43,91.75 15.11,88.06 R5.2
PA12: length 82.3
  Top Layer w0.254: v2(9.91,83.11) 9.91,87.35 R7.2 11.63,88 R6.2 ; U3.33 48.75,60.14 34.8,74.09 9.78,74.09 5.13,69.44 5.13,68.94 H2.12 5.77,68.81 v2(9.27,72.31)
  Bottom Layer w0.254: v2(9.27,72.31) 9.91,72.95 v2(9.91,83.11)
PA15: length 47.7
  Top Layer w0.254: H2.11 9.14,62.13 9.14,60.12 15.24,54.03 42.29,54.03 44.07,52.25 45.75,52.25 U3.38
PB0: length 72.2
  Top Layer w0.254: R10.2 v2(80.67,70.56) ; U3.18 65.45,49.75 72.05,56.35 H3.13
  Bottom Layer w0.254: v2(80.67,70.56) 80.79,70.56 H3.13
PB1: length 74.1
  Top Layer w0.254: U3.19 63.28,50.25 72.17,59.14 94.75,59.14 H3.14 ; R11.2 v2(79.25,74.69)
  Bottom Layer w0.254: v2(79.25,74.69) 79.25,74.64 H3.14
PB3: length 46.1
  Top Layer w0.254: H2.10 5,63.12 14.99,53.14 42.16,53.14 43.55,51.75 U3.39
PB4: length 44.9
  Top Layer w0.254: H2.9 5.54,61.19 14.35,52.38 41.78,52.38 42.91,51.25 U3.40
PB5: length 44
  Top Layer w0.254: U3.41 42.26,50.75 41.4,51.61 13.72,51.61 6.68,58.65 H2.8
PB6: length 114.7
  Top Layer w0.254: 57.71,74.44 57.71,80.24 54.59,83.36 v2(31.5,83.36) ; U3.42 41.62,50.25 41.15,50.72 13.08,50.72 7.69,56.11 H2.7
  Bottom Layer w0.254: H2.7 5,56.87 v2(31.5,83.36)
PB7: length 126.6
  Top Layer w0.254: H2.6 8.84,53.57 12.66,49.75 U3.43 ; U15.4 69.05,81.75 C16.1 57.44,70.5 47.5,80.44 v2(31.75,80.44)
  Bottom Layer w0.254: v2(31.75,80.44) 5,53.69 H2.6
PB8: length 65.3
  Top Layer w0.254: U3.45 38.54,48.75 24.13,34.34 19.8,34.34 U8.3 15.23,29.77 13.46,29.77 12.7,30.53 12.7,31.21 10.67,33.24 10.67,46.03 5.66,51.03 H2.5
PB9: length 64.5
  Top Layer w0.254: H2.4 9.53,43.97 9.53,31.04 11.68,28.88 16.88,28.88 U8.4 21.45,33.45 25.02,33.45 39.82,48.25 U3.46
PB10: length 45.3
  Top Layer w0.254: U3.21 60.47,51.25 70.98,61.76 94.75,61.76 95,61.5 H3.15
PB11: length 45.8
  Top Layer w0.254: H3.16 71.16,63.97 58.94,51.75 U3.22
PB12: length 146.7
  Top Layer w0.254: U3.25 52.75,54.83 54.74,56.82 54.74,62.79 38.5,79.03 11.45,79.03 8.51,81.97 8.51,85.14 5,88.65 H2.20
  Bottom Layer w0.254: H2.20 4.64,89.13 2.03,86.52 2.03,38.79 6.1,34.72 17.82,34.72 U8.5
PB13: length 142.3
  Top Layer w0.254: U3.26 52.25,55.48 53.97,57.2 53.97,62.41 38.1,78.28 11.18,78.28 7.87,81.58 7.87,84.08 5.36,86.59 H2.19
  Bottom Layer w0.254: H2.19 2.79,84.38 2.79,39.17 5.97,35.99 19.09,35.99 U8.6
PB14: length 66
  Top Layer w0.254: H2.18 5,83.69 11.04,77.65 37.59,77.65 53.34,61.9 53.34,57.58 51.75,55.99 U3.27
PB15: length 63.8
  Top Layer w0.254: H2.17 5.92,81.51 10.29,77.14 36.96,77.14 52.71,61.39 52.71,57.84 51.25,56.38 U3.28
PC13: length 94.6
  Top Layer w0.254: H3.2 95,28.62 v2(82.04,41.58) ; v2(36.07,63.3) 35.82,63.3 32.9,66.22 ; v2(41.78,42.93) 46.43,42.93 47.75,44.25 U3.2
  Bottom Layer w0.254: v2(82.04,41.58) 43.13,41.58 v2(41.78,42.93) 39.5,45.21 39.5,60 36.19,63.3 v2(36.07,63.3)
PC14: length 20.1
  Top Layer w0.254: 38.67,33.45 38.23,33.9 38.23,39.48 38.29,39.48 40.89,42.09 46.74,42.09 48.25,43.6 U3.3
PC15: length 17.2
  Top Layer w0.254: 41.59,33.45 42.16,34.03 42.16,39.48 45.4,39.48 48.75,42.83 U3.4
RESET: length 47.4
  Top Layer w0.254: 43.3,26.95 C1.2 43.3,12.84 SW1.2 ; 43.3,26.95 R1.1 ; 43.3,26.95 45.05,25.2 50.93,25.2 53.47,27.74 53.47,40.06 50.25,43.27 U3.7
SWCLK: length 47
  Top Layer w0.254: U3.37 44.71,52.75 42.04,55.42 v2(42.04,59.41)
  Bottom Layer w0.254: v2(42.04,59.41) 42.04,84.76 36.07,90.73 36.07,94.8 H6.3
SWIO: length 53.5
  Top Layer w0.254: v2(44.83,59.49) 48.25,56.07 U3.34
  Bottom Layer w0.254: H6.2 35.05,96.32 42.04,96.32 44.83,93.52 v2(44.83,59.49)
$1N1419: length 4.1
  Top Layer w0.254: 29.46,66.09 29.43,66.12 29.43,70.17
$1N1431: length 3.9
  Top Layer w0.254: 34.63,70.01 34.63,66.44 34.41,66.22
$1N2672: length 12.5
  Top Layer w0.254: R5.1 17.39,93.91 15.14,96.16 13.52,96.16 12.7,95.34 12.7,94.73 USB1.2
$1N2678: length 22.4
  Top Layer w0.254: USB1.3 12.06,95.68 12.92,96.53 16.42,96.53 18.54,94.41 18.54,87.05 17.85,86.36 14.9,86.36 R6.1
$1N6999: length 7.7
  Top Layer w0.254: D6.2 28.23,90 H4.1
$1N8019: length 9.6
  Top Layer w0.254: 33.28,60.88 31.91,59.51 U9.2
$1N8023: length 6.6
  Top Layer w0.254: U9.5 22.87,60.63 27.38,60.63 R9.1
$1N9090: length 8
  Top Layer w0.254: LED3.1 66.71,68.38 68.45,68.38 R10.1 ; 64.68,70.32 64.68,70.27
$1N9092: length 7.5
  Top Layer w0.254: LED4.1 66.11,76.38 68.82,76.38 R11.1
$1N15033: length 17
  Top Layer w0.254: v2(15.17,55.3) 15.17,56.35 U17.2
  Bottom Layer w0.254: 12.16,40.82 15.17,43.83 v2(15.17,55.3)
$1N15247: length 25.9
  Top Layer w0.254: 11.2,72.62 U6.3 ; v2(11.75,73.2) 11.16,72.62 ; v2(11.75,79.74) 11.75,80.95 C20.2 C17.2 12.94,85.14 19.86,85.14 SW2.5
  Bottom Layer w0.254: v2(11.75,79.74) v2(11.75,73.2)

## Copper pours and planes (outline as drawn; the poured copper is in the pictures)
GND on Bottom Layer: -20.95,101.78 122.94,101.78 122.94,-6.68 -20.95,-6.68

Small or netless copper shapes (teardrops, artwork), in the pictures only: 48 on Top Layer, 21 on Bottom Layer

## Text on the board
Top Silkscreen Layer: 3230100542 QJF
